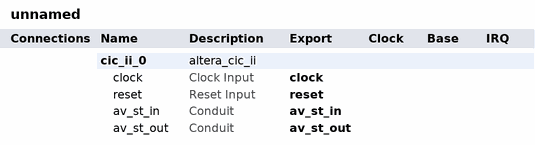
[diagram p0: system contents]
# Platform Designer (Qsys) system unnamed, Stratix IV EP4SGX230KF40C2
# Parameters at their usual value, and those the tool derives, are not listed.
package require -exact qsys 20.1
create_system unnamed
set_project_property DEVICE_FAMILY {Stratix IV}
set_project_property DEVICE EP4SGX230KF40C2

add_instance cic_ii_0 altera_cic_ii 20.1
set_instance_property cic_ii_0 AUTO_EXPORT true
set_instance_parameter_value cic_ii_0 CH_PER_INT 1
set_instance_parameter_value cic_ii_0 CLK_EN_PORT false
set_instance_parameter_value cic_ii_0 D_DELAY 1
set_instance_parameter_value cic_ii_0 FILTER_TYPE interpolator
set_instance_parameter_value cic_ii_0 INTERFACES 1
set_instance_parameter_value cic_ii_0 IN_WIDTH 8
set_instance_parameter_value cic_ii_0 RCF_FIX 8
set_instance_parameter_value cic_ii_0 RCF_LB 8
set_instance_parameter_value cic_ii_0 RCF_UB 21
set_instance_parameter_value cic_ii_0 REQ_DIF_MEM logic_element
set_instance_parameter_value cic_ii_0 REQ_INT_MEM logic_element
set_instance_parameter_value cic_ii_0 REQ_OUT_WIDTH 8
set_instance_parameter_value cic_ii_0 REQ_PIPELINE 0
set_instance_parameter_value cic_ii_0 ROUND_TYPE NONE
set_instance_parameter_value cic_ii_0 STAGES 4
set_instance_parameter_value cic_ii_0 VRC_EN 0
set_instance_parameter_value cic_ii_0 design_env NATIVE
set_instance_parameter_value cic_ii_0 hyper_opt_select 0
set_instance_parameter_value cic_ii_0 selected_device_family {Stratix IV}

# exported interfaces
add_interface av_st_in conduit end
set_interface_property av_st_in EXPORT_OF cic_ii_0.av_st_in
add_interface av_st_out conduit end
set_interface_property av_st_out EXPORT_OF cic_ii_0.av_st_out
add_interface clock clock sink
set_interface_property clock EXPORT_OF cic_ii_0.clock
add_interface reset reset sink
set_interface_property reset EXPORT_OF cic_ii_0.reset

set_interconnect_requirement {$system} qsys_mm.clockCrossingAdapter HANDSHAKE
set_interconnect_requirement {$system} qsys_mm.enableEccProtection FALSE
set_interconnect_requirement {$system} qsys_mm.insertDefaultSlave FALSE
set_interconnect_requirement {$system} qsys_mm.maxAdditionalLatency 1

save_system unnamed.qsys
